# Altium schematic sheet LedDRV.SchDoc
size 311 x 223 mm
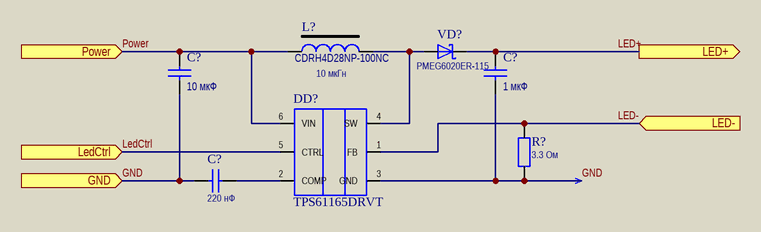
[diagram p0: LedDRV.SchDoc]

## Parts
(Parts that share a designator on the sheet are numbered #1, #2 ... from top to bottom, then left to right.)
C?#1  10 мкФ  [Chip1210]
C?#2  1 мкФ  [Chip1210]
C?#3  value 220 нФ  [Chip0603]  (hidden comment: C)
DD?  TPS61165DRVT  [WSON6]
L?  CDRH4D28NP-100NC  value 10 мкГн  [Chip1210]
R?  3.3 Ом  [Res0603]
VD?  Name: PMEG6020ER-115  [chip2218]  (hidden comment: SHOTTKY_DIODE)

## Ports
GND (in), LED+ (out), LED- (in), LedCtrl (in), Power (in)

## Nets
GND: C?#1.2 C?#2.2 C?#3.1 DD?.3(GND) DD?.7(TPad) R?.2 ; port GND
LED+: C?#2.1 VD?.1 ; port LED+
LED-: DD?.1(FB) R?.1 ; port LED-
LedCtrl: DD?.5(CTRL) ; port LedCtrl
Power: C?#1.1 DD?.6(VIN) L?.1 ; port Power
NetC?#3_2: C?#3.2 DD?.2(COMP)
NetDD?_4: DD?.4(SW) L?.2 VD?.2

## Notes on the sheet
- Перв. примен.
- М. экспертиза
- Справ. №
- Подп. и дата
- Инв. № дубл.
- Взам. инв. №
- Изм.
- Разраб.
- Лист.
- № докум.
- Подп.
- Дата
- Лит.
- Масса
- Масш.
- Инв. № подп.
- Пров.
- Т. контр.
- Н. контр.
- Утв.
- Схема электрическая
- принципиальная
- Лист
- Листов
- Копировал
- Формат А2

## Library data of the parts
C?#1 = C: Manufacturer: Any; SubClass: General Purpose; Class: Capacitors; Name: GRM32DR61E106KA12L; Author: Harry E. Zhurov; Value: 10 мкФ
C?#2 = C: Manufacturer: Any; SubClass: General Purpose; Class: Capacitors; Name: CC0603KRX5R8BB105; Author: Harry E. Zhurov; Value: 1 мкФ
C?#3 = C: Manufacturer: Any; SubClass: General Purpose; Class: Capacitors; Name: GRM188R71E224KA88D; Author: Harry E. Zhurov
DD? = TPS61165DRVT: High Brightness White LED Driver in 2mm x 2mm  QFN and SOT-23 Packages; Name: TPS61165DRVT
L? = INDUCTANCE CORE: Manufacturer: Sumida; SubClass: With Core; Class: Inductance; Author: Harry E. Zhurov; Name: CDRH4D28NP-100NC
R? = R: Manufacturer: Any; Class: Resistor; SubClass: Constant; Name: RC0603FR-073R3L; Value: 3.3 Ом
VD? = SHOTTKY_DIODE: Manufacturer: ВЗПП-С; Class: Diodes; SubClass: Shottky